# EAGLE design ota (EAGLE 7.2.0)
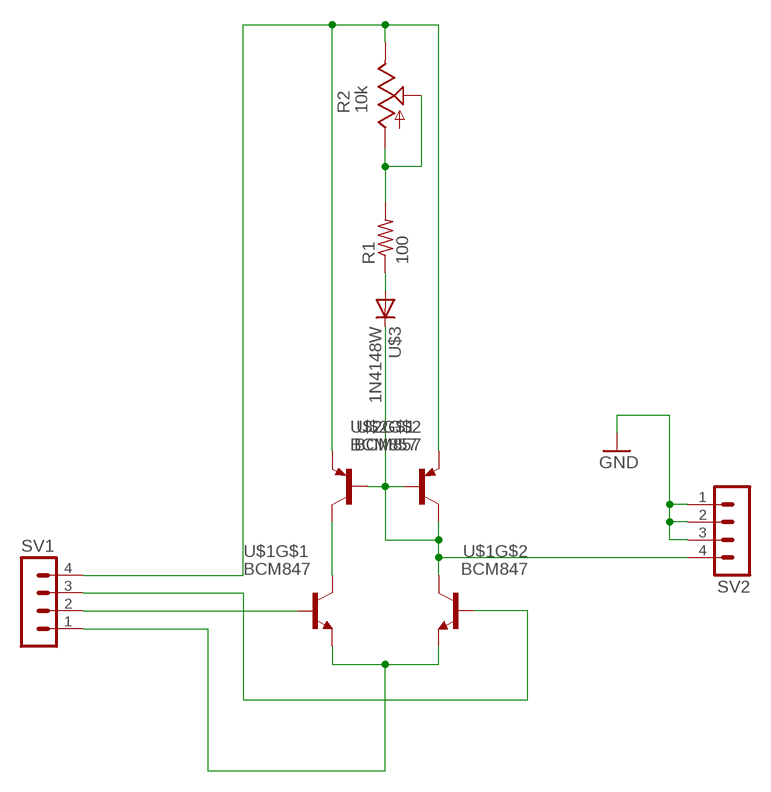
[diagram p0: schematic, sheet 1]

## Parts
R1  100  R-US_R0603  [R0603]
R2  10k  TRIM_US-SM-42/43W  [SM-42/43W]
SV1  MA04-1  [MA04-1]
SV2  MA04-1  [MA04-1]
U$1  BCM847  [SOT457R_PHILIPS]
U$2  BCM857  [SOT457R_PHILIPS]
U$3  1N4148W  [SOD123]

## Nets
GND: SV2.1 SV2.2 SV2.3
N$1: SV1.1 U$1.1(E) U$1.4(E)
N$2: U$1.6(C) U$2.3(C)
N$3: R1.2 R2.1(A) R2.2(S)
N$4: R2.3(E) SV1.4 U$2.1(E) U$2.4(E)
N$5: SV2.4 U$1.3(C) U$2.2(B) U$2.5(B) U$2.6(C) U$3.C
N$6: R1.1 U$3.A
N$8: SV1.3 U$1.5(B)
N$9: SV1.2 U$1.2(B)

## Library data of the parts
R1 = dan:R-US_: RESISTOR, American symbol
R2 = dan:TRIM_US-: POTENTIOMETER
SV1 SV2 = dan:MA04-1: PIN HEADER; OC_FARNELL: unknown; OC_NEWARK: unknown
U$1 = dan:BCM847
U$2 = dan:BCM857
U$3 = dan:1N4148W

## Board
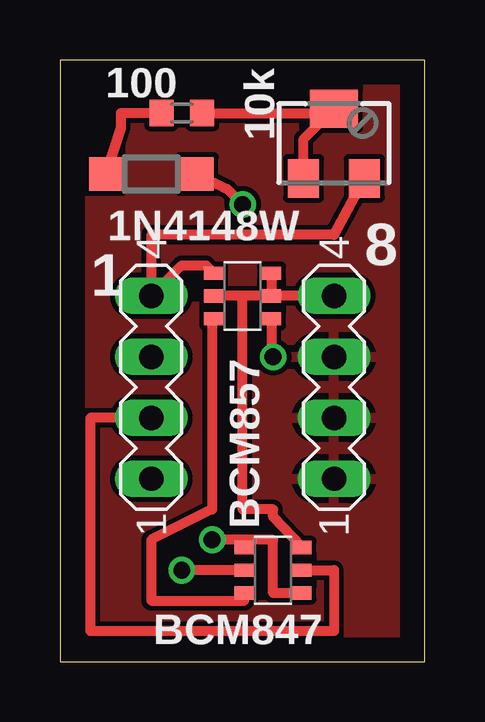
[diagram p1: board, top side]
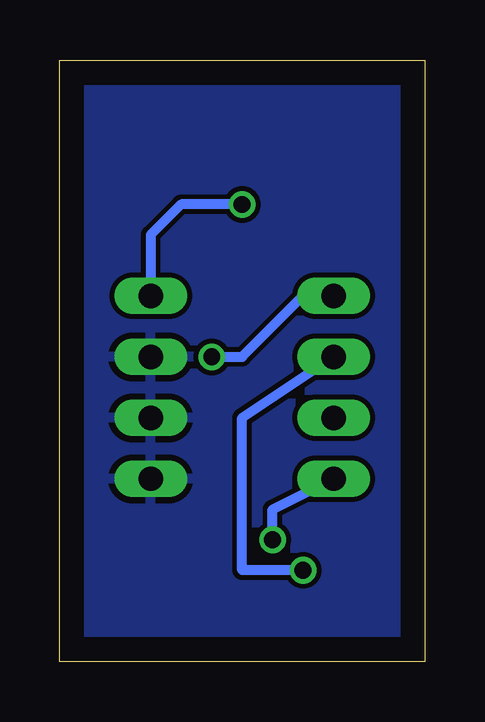
[diagram p2: board, bottom side, seen from below]

Size 15.22 x 25.07 mm. Coordinates in mm from the lower left corner, seen from the top.
Outline: 0,0 15.22,0 15.22,25.07 0,25.07 0,0
Copper layers (1*16): Top 0.035mm / dielectric 1.5mm / Bottom 0.035mm
Design rules "default": minimum track width 10mil, minimum drill 24mil, track to track 8mil, track to pad 8mil, pad to pad 8mil, via to via 8mil, smd to smd 8mil, copper to edge 40mil, drill to drill 8mil, minimum pad ring 10mil, minimum via ring 8mil, stop-mask expansion 4mil, vias tented up to drill 0mil, thermal gap 10mil

### Footprints (pad centres in the part's own frame; a part is rotated, then mirrored left to right if it is on the bottom)
R0603 = smd 1 x 1.1: 1 -0.85,0; 2 0.85,0
SM-42/43W = smd 1.3 x 1.6: 1 -1.27,-1.45; 3 1.27,-1.45 | smd 2 x 1.6: 2 0,1.45
MA04-1 = drill 1.016 long: 1 -3.81,0; 2 -1.27,0; 3 1.27,0; 4 3.81,0
SOT457R_PHILIPS = smd 0.55 x 0.8: 1 -0.95,-1.2; 2 0,-1.2; 3 0.95,-1.2; 4 0.95,1.2; 5 0,1.2; 6 -0.95,1.2
SOD123 = smd 1.4 x 1.4: A 1.9,0; C -1.9,0

### Placement (x,y rotation side)
R1  5.08,22.86 0 top
R2  11.43,21.59 0 top
SV1  3.81,11.43 90 top
SV2  11.43,11.43 90 top
U$1  8.89,3.81 90 top
U$2  7.62,15.24 270 top
U$3  3.81,20.32 180 top

### Tracks (layer width: path | path; a pad name or v marks a point on that pad's centre or on a via)
GND
  pour Top: -2.54,29.21 17.78,29.21 17.78,-2.54 -2.54,-2.54
  pour Top: -2.54,29.21 17.78,29.21 17.78,-2.54 -2.54,-2.54
  pour Bottom: -1.27,27.94 16.51,27.94 16.51,-1.27 -1.27,-1.27
N$1  (via drill 0.7)
  Top 0.406: U$1.1 8.89,2.86 8.89,5.08 7.69,5.08 | 7.69,5.08 U$1.4 | 7.69,5.08 v6.35,5.08
  Bottom 0.406: v6.35,5.08 6.35,6.35 SV1.1
N$2
  Top 0.406: U$2.3 6.35,14.29 6.35,6.35 3.81,5.08 3.81,2.54 7.69,2.54 U$1.6
N$3
  Top 0.406: R1.2 11.25,22.86 R2.2 10.16,21.77 R2.1
N$4  (via drill 0.7)
  Top 0.406: U$2.1 6.1,16.51 5.08,16.51 SV1.4 3.81,17.78 11.43,17.78 R2.3 | U$2.4 8.82,12.77 v8.89,12.7
  Bottom 0.406: v8.89,12.7 7.62,12.7 5.08,15.24 SV1.4
N$5  (via drill 0.7)
  Top 0.406: U$1.3 8.89,6.03 8.89,6.35 7.62,6.35 7.62,15.24 | 7.62,15.24 U$2.2 | U$2.6 U$2.5 | U$2.5 7.62,15.24 | SV2.4 U$2.5 | U$3.C 6.98,19.69 v7.62,19.05
  Bottom 0.406: v7.62,19.05 10.16,19.05 11.43,17.78 SV2.4
N$6
  Top 0.406: R1.1 2.54,22.86 2.54,22.23 U$3.A
N$8  (via drill 0.7)
  Top 0.406: U$1.5 v5.08,3.81
  Bottom 0.406: v5.08,3.81 7.62,3.81 7.62,10.16 SV1.3
N$9
  Top 0.406: U$1.2 11.43,3.81 11.43,1.27 1.27,1.27 1.27,10.16 SV1.2

### Text on the board
tPlace: 8 | 1